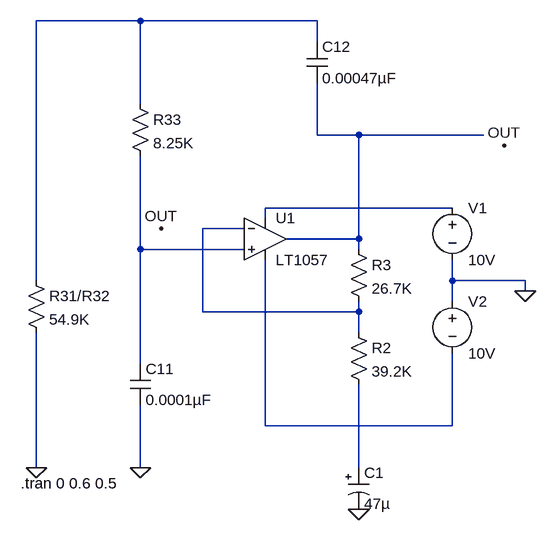
[diagram p0: schematic OpAmpOszillator.asc]
OpAmpOszillator.asc, the LTspice schematic file:
Version 4
SHEET 1 880 680
WIRE -32 -320 -192 -320
WIRE 240 -320 -32 -320
WIRE 240 -288 240 -320
WIRE -32 -192 -32 -320
WIRE 240 -144 240 -224
WIRE 304 -144 240 -144
WIRE 496 -144 304 -144
WIRE 448 -32 160 -32
WIRE 160 -16 160 -32
WIRE 128 0 64 0
WIRE 304 16 304 -144
WIRE 304 16 192 16
WIRE -32 32 -32 -112
WIRE 128 32 -32 32
WIRE 304 32 304 16
WIRE -192 80 -192 -320
WIRE 448 80 448 48
WIRE 560 80 448 80
WIRE 560 96 560 80
WIRE 448 112 448 80
WIRE 64 128 64 0
WIRE 304 128 304 112
WIRE 304 128 64 128
WIRE 304 160 304 128
WIRE -32 208 -32 32
WIRE 160 304 160 48
WIRE 448 304 448 192
WIRE 448 304 160 304
WIRE -192 368 -192 160
WIRE -32 368 -32 272
WIRE 304 368 304 240
FLAG 304 432 0
FLAG -32 368 0
FLAG -192 368 0
FLAG 560 96 0
FLAG 528 -128 OUT
FLAG 0 0 OUT
SYMBOL res -208 64 R0
SYMATTR InstName R31/R32
SYMATTR Value 54.9K
SYMATTR SpiceLine tol=1 pwr=0.1
SYMBOL res 288 144 R0
SYMATTR InstName R2
SYMATTR Value 39.2K
SYMATTR SpiceLine tol=1 pwr=0.1
SYMBOL res 288 16 R0
SYMATTR InstName R3
SYMATTR Value 26.7K
SYMATTR SpiceLine tol=1 pwr=0.1
SYMBOL res -48 -208 R0
SYMATTR InstName R33
SYMATTR Value 8.25K
SYMATTR SpiceLine tol=1 pwr=0.1
SYMBOL cap -48 208 R0
SYMATTR InstName C11
SYMATTR Value 0.0001µF
SYMATTR SpiceLine V=6.3 Irms=69m Rser=1.54306 Lser=0
SYMBOL cap 224 -288 R0
SYMATTR InstName C12
SYMATTR Value 0.00047µF
SYMATTR SpiceLine V=6.3 Irms=69m Rser=1.54306 Lser=0
SYMBOL voltage 448 -48 R0
WINDOW 123 0 0 Left 2
WINDOW 39 0 0 Left 2
SYMATTR InstName V1
SYMATTR Value 10V
SYMBOL voltage 448 96 R0
WINDOW 123 0 0 Left 2
WINDOW 39 0 0 Left 2
SYMATTR InstName V2
SYMATTR Value 10V
SYMBOL polcap 288 368 R0
WINDOW 3 24 56 Left 2
SYMATTR Value 47µ
SYMATTR InstName C1
SYMATTR Description Capacitor
SYMATTR Type cap
SYMATTR SpiceLine V=50 Irms=125m Rser=0.8 Lser=0 mfg="Nichicon" pn="UPR1H470MPH" type="Al electrolytic"
SYMBOL Opamps\\LT1057 160 -48 R0
SYMATTR InstName U1
TEXT -216 392 Left 2 !.tran 0 0.6 0.5

The netlist it stands for:
* OpAmpOszillator.asc
R31/R32 N001 0 54.9K tol=1 pwr=0.1
R2 N004 N007 39.2K tol=1 pwr=0.1
R3 N002 N004 26.7K tol=1 pwr=0.1
R33 N001 N005 8.25K tol=1 pwr=0.1
C11 N005 0 0.0001µF V=6.3 Irms=69m Rser=1.54306 Lser=0
C12 N001 N002 0.00047µF V=6.3 Irms=69m Rser=1.54306 Lser=0
V1 N003 0 10V
V2 0 N006 10V
C1 N007 0 47µ V=50 Irms=125m Rser=0.8 Lser=0 mfg="Nichicon" pn="UPR1H470MPH" type="Al electrolytic"
XU1 N005 N004 N003 N006 N002 LT1057  ; pins In+ In- V+ V- OUT
.tran 0 0.6 0.5
.lib LTC.lib
.backanno
.end